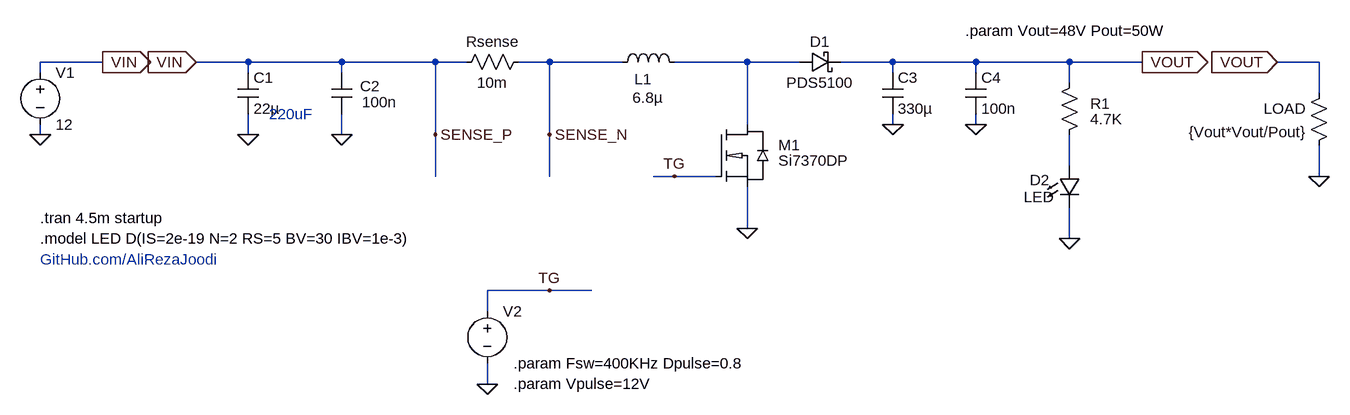
[diagram p0: schematic _PowerStage.asc]
_PowerStage.asc, the LTspice schematic file:
Version 4.1
SHEET 1 3476 1972
WIRE 1088 -48 992 -48
WIRE 1312 -48 1232 -48
WIRE 1456 -48 1312 -48
WIRE 1600 -48 1456 -48
WIRE 1648 -48 1600 -48
WIRE 1776 -48 1728 -48
WIRE 1888 -48 1776 -48
WIRE 2080 -48 1968 -48
WIRE 2160 -48 2080 -48
WIRE 2304 -48 2224 -48
WIRE 2432 -48 2304 -48
WIRE 2576 -48 2432 -48
WIRE 2688 -48 2576 -48
WIRE 2960 -48 2896 -48
WIRE 992 -32 992 -48
WIRE 1312 -32 1312 -48
WIRE 1456 -32 1456 -48
WIRE 2304 -32 2304 -48
WIRE 2432 -32 2432 -48
WIRE 2576 -16 2576 -48
WIRE 2960 0 2960 -48
WIRE 2080 48 2080 -48
WIRE 2304 48 2304 32
WIRE 2432 48 2432 32
WIRE 992 64 992 48
WIRE 1312 64 1312 32
WIRE 1456 64 1456 32
WIRE 1600 64 1600 -48
WIRE 1776 64 1776 -48
WIRE 2576 112 2576 64
WIRE 1600 128 1600 64
WIRE 1776 128 1776 64
WIRE 1968 128 1936 128
WIRE 2032 128 1968 128
WIRE 2960 128 2960 80
WIRE 2080 208 2080 144
WIRE 2576 224 2576 176
WIRE 1776 304 1680 304
WIRE 1840 304 1776 304
WIRE 1680 336 1680 304
WIRE 1680 448 1680 416
FLAG 2304 48 0
FLAG 2960 128 0
FLAG 992 64 0
FLAG 2688 -48 VOUT
IOPIN 2688 -48 Out
FLAG 1088 -48 VIN
IOPIN 1088 -48 Out
FLAG 1456 64 0
FLAG 2432 48 0
FLAG 1968 128 TG
FLAG 1312 64 0
FLAG 2080 208 0
FLAG 1232 -48 VIN
IOPIN 1232 -48 In
FLAG 2896 -48 VOUT
IOPIN 2896 -48 In
FLAG 1600 64 SENSE_P
FLAG 1776 64 SENSE_N
FLAG 1680 448 0
FLAG 1776 304 TG
FLAG 2576 224 0
SYMBOL schottky 2160 -64 M90
WINDOW 0 0 32 VBottom 2
WINDOW 3 32 32 VTop 2
SYMATTR InstName D1
SYMATTR Value PDS5100
SYMATTR Description Diode
SYMATTR Type diode
SYMBOL ind 1872 -32 R270
WINDOW 0 -26 48 VTop 2
WINDOW 3 -23 55 VBottom 2
SYMATTR InstName L1
SYMATTR Value 6.8µ
SYMATTR SpiceLine Rser=13.1m
SYMBOL res 1632 -32 R270
WINDOW 0 32 56 VTop 2
WINDOW 3 0 56 VBottom 2
SYMATTR InstName Rsense
SYMATTR Value 10m
SYMBOL voltage 992 -48 R0
WINDOW 123 24 138 Left 2
WINDOW 39 24 117 Left 2
SYMATTR Value 12
SYMATTR InstName V1
SYMBOL res 2976 -16 M0
SYMATTR InstName LOAD
SYMATTR Value {Vout*Vout/Pout}
SYMBOL cap 1440 -32 R0
WINDOW 0 44 21 Left 2
WINDOW 3 47 46 Left 2
SYMATTR InstName C2
SYMATTR Value 100n
SYMBOL cap 1296 -32 R0
SYMATTR InstName C1
SYMATTR Value 22µ
SYMBOL cap 2416 -32 R0
SYMATTR InstName C4
SYMATTR Value 100n
SYMBOL cap 2288 -32 R0
SYMATTR InstName C3
SYMATTR Value 330µ
SYMBOL voltage 1680 320 R0
WINDOW 3 41 64 Invisible 2
WINDOW 123 0 0 Left 0
WINDOW 39 0 0 Left 0
SYMATTR Value PULSE(0 {Vpulse} 0 {0.01/Fsw} {0.01/Fsw} {Dpulse/Fsw} {1/Fsw})
SYMATTR InstName V2
SYMBOL MyLib\\Transistor_MOSFET_N\\MOSFET_N 2032 48 R0
SYMATTR InstName M1
SYMATTR Value Si7370DP
SYMBOL LED 2560 112 R0
WINDOW 0 -45 22 Left 2
WINDOW 3 -54 48 Left 2
SYMATTR InstName D2
SYMATTR Value LED
SYMBOL res 2560 80 M180
WINDOW 0 48 64 Left 2
WINDOW 3 48 40 Left 2
SYMATTR InstName R1
SYMATTR Value 4.7K
TEXT 992 192 Left 2 !.tran 4.5m startup
TEXT 992 256 Left 2 ;GitHub.com/AliRezaJoodi
TEXT 2416 -96 Left 2 !.param Vout=48V Pout=50W
TEXT 1344 32 Left 2 ;220uF
TEXT 1720 416 Left 2 !.param Fsw=400KHz Dpulse=0.8\n.param Vpulse=12V
TEXT 992 224 Left 2 !.model LED D(IS=2e-19 N=2 RS=5 BV=30 IBV=1e-3)

The netlist it stands for:
* _PowerStage.asc
D1 N001 VOUT PDS5100
L1 SENSE_N N001 6.8µ Rser=13.1m
Rsense SENSE_P SENSE_N 10m
V1 SENSE_P 0 12
R§LOAD VOUT 0 {Vout*Vout/Pout}
C2 SENSE_P 0 100n
C1 SENSE_P 0 22µ
C4 VOUT 0 100n
C3 VOUT 0 330µ
V2 TG 0 PULSE(0 {Vpulse} 0 {0.01/Fsw} {0.01/Fsw} {Dpulse/Fsw} {1/Fsw})
M1 N001 TG 0 0 Si7370DP
D2 N002 0 LED
R1 N002 VOUT 4.7K
.model D D
.lib standard.dio
.model NMOS NMOS
.model PMOS PMOS
.lib standard.mos
.tran 4.5m startup
* GitHub.com/AliRezaJoodi
.param Vout=48V Pout=50W
* 220uF
.param Fsw=400KHz Dpulse=0.8
.param Vpulse=12V
.model LED D(IS=2e-19 N=2 RS=5 BV=30 IBV=1e-3)
.backanno
.end